# EAGLE design Preamp (EAGLE 5.07)
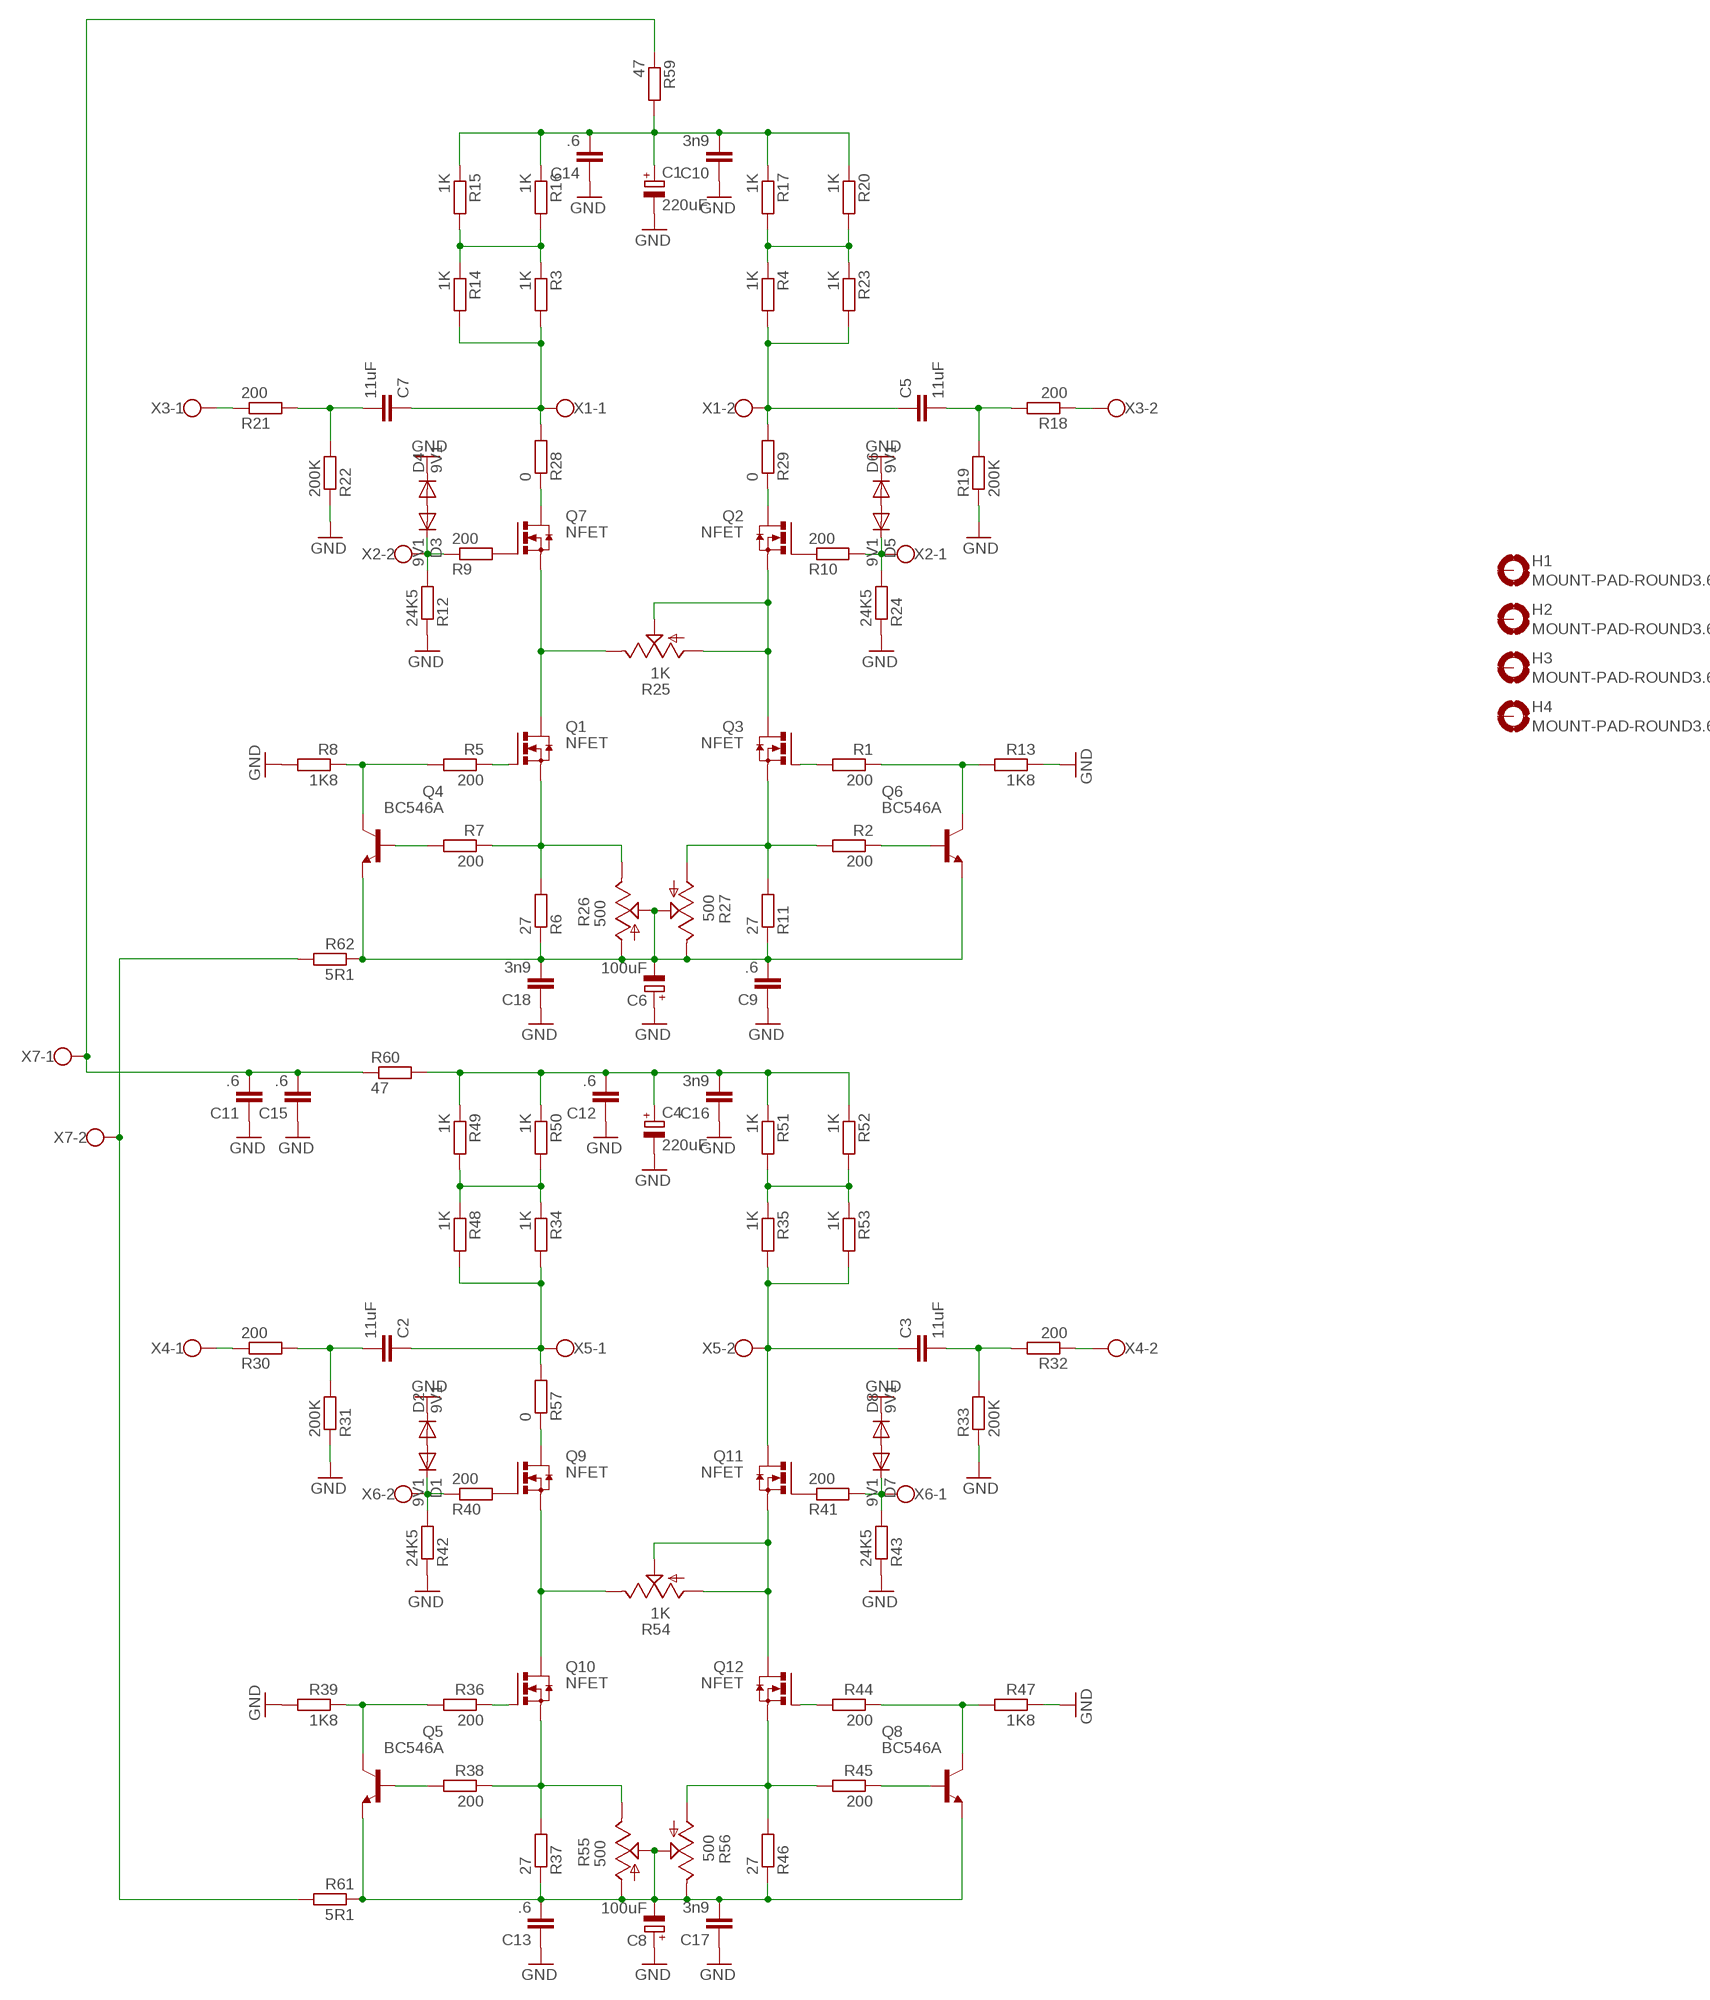
[diagram p0: schematic, sheet 1]

## Parts
C1  220uF  CPOL-EUE7.5-16  [E7,5-16]
C2  11uF  C-EU375-203X418  [C375-203X418]
C3  11uF  C-EU375-203X418  [C375-203X418]
C4  220uF  CPOL-EUE7.5-16  [E7,5-16]
C5  11uF  C-EU375-203X418  [C375-203X418]
C6  100uF  CPOL-EUE5-10.5  [E5-10,5]
C7  11uF  C-EU375-203X418  [C375-203X418]
C8  100uF  CPOL-EUE5-10.5  [E5-10,5]
C9  .6  C-EU050-045X075  [C050-045X075]
C10  3n9  C-EUC1210K  [C1210K]
C11  .6  C-EU050-045X075  [C050-045X075]
C12  .6  C-EU050-045X075  [C050-045X075]
C13  .6  C-EU050-045X075  [C050-045X075]
C14  .6  C-EU050-045X075  [C050-045X075]
C15  .6  C-EU050-045X075  [C050-045X075]
C16  3n9  C-EUC1210K  [C1210K]
C17  3n9  C-EUC1210K  [C1210K]
C18  3n9  C-EUC1210K  [C1210K]
D1  9V1  1N4148DO35-7  [DO35-7]
D2  9V1  1N4148DO35-7  [DO35-7]
D3  9V1  1N4148DO35-7  [DO35-7]
D4  9V1  1N4148DO35-7  [DO35-7]
D5  9V1  1N4148DO35-7  [DO35-7]
D6  9V1  1N4148DO35-7  [DO35-7]
D7  9V1  1N4148DO35-7  [DO35-7]
D8  9V1  1N4148DO35-7  [DO35-7]
H1  MOUNT-PAD-ROUND3.6  [3,6-PAD]
H2  MOUNT-PAD-ROUND3.6  [3,6-PAD]
H3  MOUNT-PAD-ROUND3.6  [3,6-PAD]
H4  MOUNT-PAD-ROUND3.6  [3,6-PAD]
Q1  NFET  IRFI540NPBF  [TO220BH]
Q2  NFET  IRFI540NPBF  [TO220BH]
Q3  NFET  IRFI540NPBF  [TO220BH]
Q4  BC546A  [TO92-EBC]
Q5  BC546A  [TO92-EBC]
Q6  BC546A  [TO92-EBC]
Q7  NFET  IRFI540NPBF  [TO220BH]
Q8  BC546A  [TO92-EBC]
Q9  NFET  IRFI540NPBF  [TO220BH]
Q10  NFET  IRFI540NPBF  [TO220BH]
Q11  NFET  IRFI540NPBF  [TO220BH]
Q12  NFET  IRFI540NPBF  [TO220BH]
R1  200  R-EU_0207/10  [0207/10]
R2  200  R-EU_0207/10  [0207/10]
R3  1K  R-EU_0617/22  [0617/22]
R4  1K  R-EU_0617/22  [0617/22]
R5  200  R-EU_0207/10  [0207/10]
R6  27  R-EU_0207/10  [0207/10]
R7  200  R-EU_0207/10  [0207/10]
R8  1K8  R-EU_0207/10  [0207/10]
R9  200  R-EU_0207/10  [0207/10]
R10  200  R-EU_0207/10  [0207/10]
R11  27  R-EU_0207/10  [0207/10]
R12  24K5  R-EU_0207/10  [0207/10]
R13  1K8  R-EU_0207/10  [0207/10]
R14  1K  R-EU_0617/22  [0617/22]
R15  1K  R-EU_0617/22  [0617/22]
R16  1K  R-EU_0617/22  [0617/22]
R17  1K  R-EU_0617/22  [0617/22]
R18  200  R-EU_0207/10  [0207/10]
R19  200K  R-EU_0207/10  [0207/10]
R20  1K  R-EU_0617/22  [0617/22]
R21  200  R-EU_0207/10  [0207/10]
R22  200K  R-EU_0207/10  [0207/10]
R23  1K  R-EU_0617/22  [0617/22]
R24  24K5  R-EU_0207/10  [0207/10]
R25  1K  TRIM_US-RJ9W  [RJ9W]
R26  500  TRIM_US-RJ9W  [RJ9W]
R27  500  TRIM_US-RJ9W  [RJ9W]
R28  0  R-EU_0207/10  [0207/10]
R29  0  R-EU_0207/10  [0207/10]
R30  200  R-EU_0207/10  [0207/10]
R31  200K  R-EU_0207/10  [0207/10]
R32  200  R-EU_0207/10  [0207/10]
R33  200K  R-EU_0207/10  [0207/10]
R34  1K  R-EU_0617/22  [0617/22]
R35  1K  R-EU_0617/22  [0617/22]
R36  200  R-EU_0207/10  [0207/10]
R37  27  R-EU_0207/10  [0207/10]
R38  200  R-EU_0207/10  [0207/10]
R39  1K8  R-EU_0207/10  [0207/10]
R40  200  R-EU_0207/10  [0207/10]
R41  200  R-EU_0207/10  [0207/10]
R42  24K5  R-EU_0207/10  [0207/10]
R43  24K5  R-EU_0207/10  [0207/10]
R44  200  R-EU_0207/10  [0207/10]
R45  200  R-EU_0207/10  [0207/10]
R46  27  R-EU_0207/10  [0207/10]
R47  1K8  R-EU_0207/10  [0207/10]
R48  1K  R-EU_0617/22  [0617/22]
R49  1K  R-EU_0617/22  [0617/22]
R50  1K  R-EU_0617/22  [0617/22]
R51  1K  R-EU_0617/22  [0617/22]
R52  1K  R-EU_0617/22  [0617/22]
R53  1K  R-EU_0617/22  [0617/22]
R54  1K  TRIM_US-RJ9W  [RJ9W]
R55  500  TRIM_US-RJ9W  [RJ9W]
R56  500  TRIM_US-RJ9W  [RJ9W]
R57  0  R-EU_0207/10  [0207/10]
R59  47  R-EU_0617/22  [0617/22]
R60  47  R-EU_0617/22  [0617/22]
R61  5R1  R-EU_0207/10  [0207/10]
R62  5R1  R-EU_0207/10  [0207/10]
X1  W237-02P  [W237-132]
X2  W237-02P  [W237-132]
X3  W237-02P  [W237-132]
X4  W237-02P  [W237-132]
X5  W237-02P  [W237-132]
X6  W237-02P  [W237-132]
X7  W237-02P  [W237-132]

## Nets
GND: C1.- C4.- C6.+ C8.+ C9.1 C10.1 C11.1 C12.1 C13.1 C14.1 C15.1 C16.1 C17.1 C18.1 D2.C D4.C D6.C D8.C R8.2 R12.1 R13.1 R19.1 R22.1 R24.1 R31.1 R33.1 R39.2 R42.1 R43.1 R47.1
N$1: Q3.S R2.2 R11.2 R27.A
N$2: Q3.G R1.2
N$3: Q6.B R2.1
N$4: Q6.C R1.1 R13.2
N$5: Q1.G R5.1
N$6: C6.- C9.2 C18.2 Q4.E Q6.E R6.1 R11.1 R26.A R26.S R27.E R27.S R62.1
N$7: Q4.B R7.2
N$8: Q1.S R6.2 R7.1 R26.E
N$9: Q4.C R5.2 R8.1
N$10: Q7.G R9.2
N$11: R3.1 R14.1 R15.2 R16.2
N$12: Q2.G R10.1
N$13: C7.1 R3.2 R14.2 R28.2 X1.1
N$14: Q1.D Q7.S R25.E
N$15: D3.C R9.1 R12.2 X2.2
N$16: Q2.S Q3.D R25.A R25.S
N$17: D5.C R10.2 R24.2 X2.1
N$18: Q7.D R28.1
N$19: R4.1 R17.2 R20.2 R23.1
N$20: Q2.D R29.1
N$21: R21.1 X3.1
N$22: C1.+ C10.2 C14.2 R15.1 R16.1 R17.1 R20.1 R59.2
N$23: C2.1 R34.2 R48.2 R57.2 X5.1
N$24: C2.2 R30.2 R31.2
N$25: C3.2 R32.2 R33.2
N$26: C7.2 R21.2 R22.2
N$27: C5.2 R18.2 R19.2
N$29: R30.1 X4.1
N$30: C5.1 R4.2 R23.2 R29.2 X1.2
N$31: R32.1 X4.2
N$32: Q10.G R36.1
N$42: C8.- C13.2 C17.2 Q5.E Q8.E R37.1 R46.1 R55.A R55.S R56.E R56.S R61.1
N$43: Q5.B R38.2
N$44: Q10.S R37.2 R38.1 R55.E
N$45: Q5.C R36.2 R39.1
N$52: R18.1 X3.2
N$53: D1.C R40.1 R42.2 X6.2
N$54: D7.C R41.2 R43.2 X6.1
N$55: D1.A D2.A
N$56: D7.A D8.A
N$57: Q12.S R45.2 R46.2 R56.A
N$58: Q12.G R44.2
N$59: Q8.B R45.1
N$60: Q8.C R44.1 R47.2
N$61: Q9.S Q10.D R54.E
N$62: Q11.S Q12.D R54.A R54.S
N$63: R34.1 R48.1 R49.2 R50.2
N$64: R35.1 R51.2 R52.2 R53.1
N$65: C4.+ C12.2 C16.2 R49.1 R50.1 R51.1 R52.1 R60.2
N$66: Q9.G R40.2
N$67: Q11.G R41.1
N$68: Q9.D R57.1
N$69: C3.1 Q11.D R35.2 R53.2 X5.2
N$70: C11.2 C15.2 R59.1 R60.1 X7.1
N$71: R61.2 R62.2 X7.2
N$80: D3.A D4.A
N$81: D5.A D6.A
Unconnected: H1.B3,6(MOUNT) H2.B3,6(MOUNT) H3.B3,6(MOUNT) H4.B3,6(MOUNT)

## Library data of the parts
C1 C4 C6 C8 = resistor:CPOL-EU: POLARIZED CAPACITOR, European symbol
C2 C3 C5 C7 C9-C18 = resistor:C-EU: CAPACITOR, European symbol
D1-D8 = diode:1N4148: DIODE high speed (Philips)
H1-H4 = holes:MOUNT-PAD-ROUND: MOUNTING PAD, round
Q1-Q3 Q7 Q9-Q12 = transistor-power:IRFI540NPBF: HEXFET Power MOISFET VDSS = 100V, RDS(on) = 0.052 Ohm, ID = 20A, VGS(th) = 2.0 -- 4.0V Source: http://www.irf.com/product-info/datasheets/data/irfi540npbf.pdf
Q4-Q6 Q8 = transistor-npn:BC546*: NPN Transistor
R1-R24 R28-R53 R57 R59-R62 = resistor:R-EU_: RESISTOR, European symbol
R25-R27 R54-R56 = pot:TRIM_US-: POTENTIOMETER
X1-X7 = con-wago-508:W237-02P: WAGO SREW CLAMP

## Board
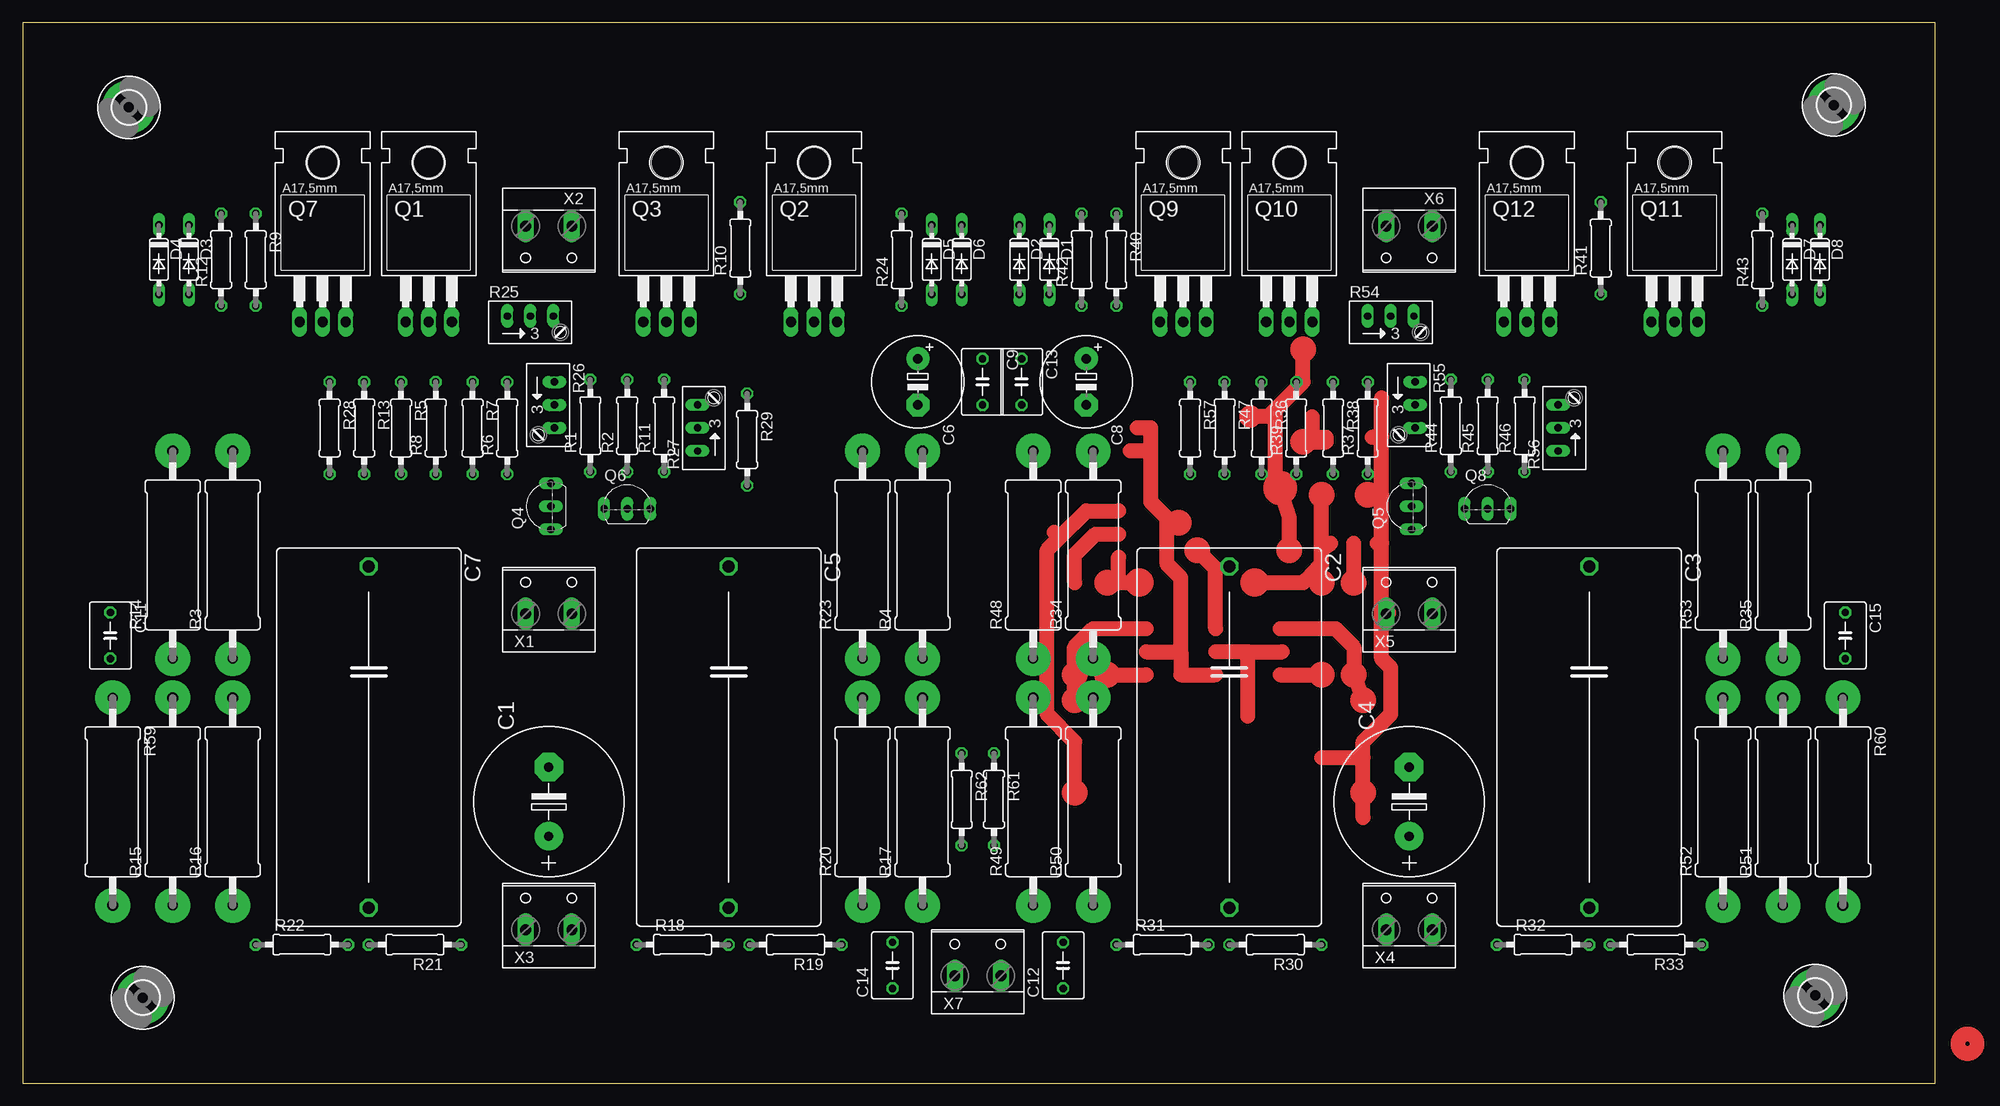
[diagram p1: board, top side]
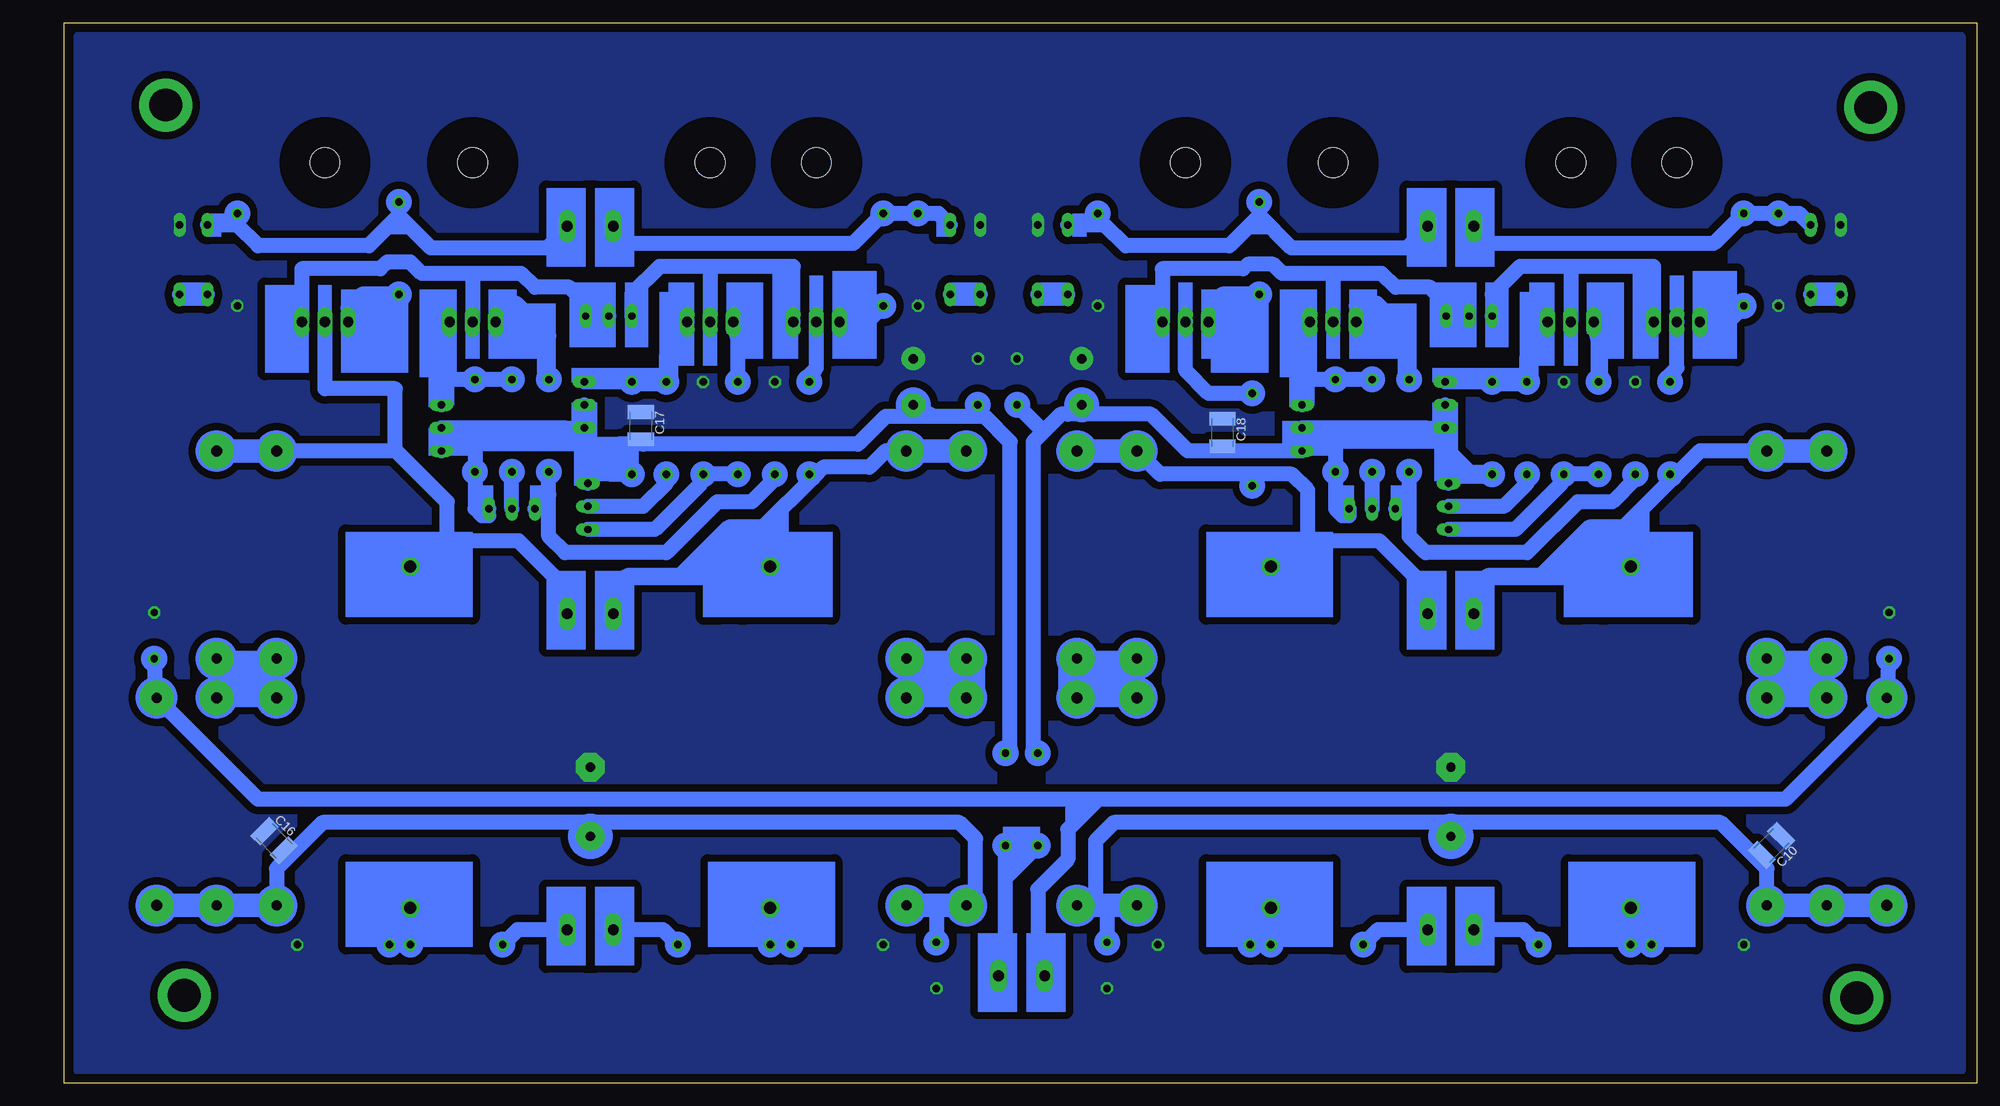
[diagram p2: board, bottom side, seen from below]

Size 210.55 x 116.76 mm. Coordinates in mm from the lower left corner, seen from the top.
Outline: 0,0 210.55,0 210.55,116.76 0,116.76 0,0
Copper layers (1*16): Top 0.035mm / dielectric 1.5mm / Bottom 0.035mm
Design rules: minimum track width 10mil, minimum drill 24mil, track to track 8mil, track to pad 8mil, pad to pad 8mil, via to via 8mil, smd to smd 8mil, copper to edge 40mil, drill to drill 8mil, minimum pad ring 10mil, minimum via ring 8mil, stop-mask expansion 4mil, vias tented up to drill 0mil, thermal gap 10mil

### Footprints (pad centres in the part's own frame; a part is rotated, then mirrored left to right if it is on the bottom)
E7,5-16 = drill 1.016 pad 3.15: + -3.81,0 | drill 1.016 pad 3.15 octagon: - 3.81,0
C375-203X418 = drill 1.321 octagon: 1 -18.796,0; 2 18.796,0
E5-10,5 = drill 1.016 pad 2.54: + -2.54,0 | drill 1.016 pad 2.54 octagon: - 2.54,0
C050-045X075 = drill 0.813 octagon: 1 -2.54,0; 2 2.54,0
C1210K = smd 1.5 x 2.9: 1 -1.5,0; 2 1.5,0
DO35-7 = drill 0.813 long: A 3.81,0; C -3.81,0
3,6-PAD = drill 3.6 pad 5.842: B3,6 0,0
TO220BH = drill 1.118 long: D 0,-6.35; G -2.54,-6.35; S 2.54,-6.35 | hole 3.302: 0,11.176
TO92-EBC = drill 0.813 long: B 0,-1.27; C -2.54,-1.27; E 2.54,-1.27
0207/10 = drill 0.813 octagon: 1 -5.08,0; 2 5.08,0
0617/22 = drill 1.1 pad 3.81: 1 -11.43,0 | drill 1.2 pad 3.81: 2 11.43,0
RJ9W = drill 0.813 long: A 2.54,0.635; E -2.54,0.635; S 0,0.635
W237-132 = drill 1.194 long: 1 -2.54,-0.635; 2 2.54,-0.635

### Placement (x,y rotation side)
C1  57.91,30.99 90 top
C2  132.84,38.1 270 top
C3  172.47,38.1 270 top
C4  152.65,30.99 90 top
C5  77.72,38.1 270 top
C6  98.55,77.22 270 top
C7  38.1,38.1 270 top
C8  117.09,77.22 270 top
C9  105.66,77.22 270 top
C10  22.61,26.16 225 bottom
C11  9.65,49.28 270 top
C12  114.55,12.95 90 top
C13  109.98,77.22 270 top
C14  95.76,12.95 90 top
C15  200.66,49.28 270 top
C16  187.45,26.67 314.9 bottom
C17  147.07,72.39 270 bottom
C18  83.06,71.63 270 bottom
D1  113.03,90.68 270 top
D2  109.73,90.68 270 top
D3  18.29,90.68 270 top
D4  14.99,90.68 270 top
D5  100.08,90.68 270 top
D6  103.38,90.68 270 top
D7  194.82,90.68 270 top
D8  197.87,90.68 270 top
H1  13.21,9.4 0 top
H2  197.36,9.65 0 top
H3  11.68,107.44 0 top
H4  199.39,107.7 0 top
Q1  44.7,90.17 0 top
Q2  87.12,90.17 0 top
Q3  70.87,90.17 0 top
Q4  56.9,63.5 90 top
Q5  151.64,63.5 90 top
Q6  66.55,64.52 0 top
Q7  33.02,90.17 0 top
Q8  161.29,64.52 0 top
Q9  127.76,90.17 0 top
Q10  139.45,90.17 0 top
Q11  181.86,90.17 0 top
Q12  165.61,90.17 0 top
R1  62.48,72.39 90 top
R2  66.55,72.39 90 top
R3  23.11,58.17 90 top
R4  99.06,58.17 90 top
R5  41.66,72.14 270 top
R6  53.34,72.14 90 top
R7  49.53,72.14 270 top
R8  45.47,72.14 90 top
R9  25.65,90.68 270 top
R10  78.99,91.95 90 top
R11  70.61,72.39 90 top
R12  21.84,90.68 90 top
R13  37.59,72.14 270 top
R14  16.51,58.17 90 top
R15  16.51,30.99 90 top
R16  23.11,30.99 90 top
R17  99.06,30.99 90 top
R18  72.64,15.24 0 top
R19  85.09,15.24 180 top
R20  92.46,30.99 90 top
R21  43.18,15.24 180 top
R22  30.73,15.24 0 top
R23  92.46,58.17 90 top
R24  96.77,90.68 90 top
R25  55.88,83.82 0 top
R26  57.91,74.68 270 top
R27  74.93,72.14 90 top
R28  33.78,72.14 270 top
R29  79.76,70.87 270 top
R30  137.92,15.24 180 top
R31  125.48,15.24 0 top
R32  167.39,15.24 0 top
R33  179.83,15.24 180 top
R34  117.86,58.17 90 top
R35  193.8,58.17 90 top
R36  136.4,72.14 270 top
R37  148.08,72.14 90 top
R38  144.27,72.14 270 top
R39  140.21,72.14 90 top
R40  120.4,90.68 270 top
R41  173.74,91.95 90 top
R42  116.59,90.68 90 top
R43  191.52,90.68 90 top
R44  157.23,72.39 90 top
R45  161.29,72.39 90 top
R46  165.35,72.39 90 top
R47  132.33,72.14 270 top
R48  111.25,58.17 90 top
R49  111.25,30.99 90 top
R50  117.86,30.99 90 top
R51  193.8,30.99 90 top
R52  187.2,30.99 90 top
R53  187.2,58.17 90 top
R54  150.62,83.82 0 top
R55  152.65,74.68 270 top
R56  169.67,72.14 90 top
R57  128.52,72.14 270 top
R59  9.91,30.99 270 top
R60  200.41,30.99 270 top
R61  106.93,31.24 270 top
R62  103.38,31.24 270 top
X1  57.91,52.32 0 top
X2  57.91,93.73 180 top
X3  57.91,17.53 0 top
X4  152.65,17.53 0 top
X5  152.65,52.32 0 top
X6  152.65,93.73 180 top
X7  105.16,12.45 0 top

### Tracks (layer width: path | path; a pad name or v marks a point on that pad's centre or on a via)
GND
  pour Bottom (isolate 0.813, no thermals): 2.03,115.06 2.03,1.52 208.79,1.52 208.79,115.06
N$1
  Bottom 1.676: R2.2 R11.2 74.3,77.47 | Q3.S 74.3,82.93 74.3,77.47 | 74.3,77.47 R27.A
N$2
  Bottom 1.676: R1.2 62.48,82.3 66.04,85.85 68.07,85.85 68.33,85.6 Q3.G
N$3
  Bottom 1.676: Q6.B R2.1
N$4
  Bottom 1.676: 62.48,64.77 Q6.C | 62.48,64.77 R1.1 | R13.2 37.59,66.55 40.13,64.01 43.94,64.01 49.53,58.42 60.71,58.42 62.48,60.2 62.48,64.77
N$5
  Bottom 1.676: Q1.G 41.66,81.79 R5.1
N$6
  Bottom 0.406: C18.2 83.31,70.13 83.31,69.6
  Bottom 1.676: R27.S R27.E | R6.1 55.63,67.06 | R26.S R26.A 58.55,69.98 | 58.55,69.98 60.71,72.14 70.61,72.14 | 70.61,72.14 R27.S | 70.61,72.14 R11.1 70.61,63.25 69.85,62.48 69.09,62.48 Q6.E | 55.63,67.06 58.55,69.98 | Q4.E 57.15,67.06 55.63,67.06 | R27.S 74.3,69.72 74.42,69.6 83.31,69.6 86.87,69.6 90.93,73.66 100.08,73.66 | 100.08,73.66 C6.- | 100.08,73.66 100.84,73.66 102.74,71.75 | R62.1 103.89,36.83 103.89,70.61 102.74,71.75 | 102.74,71.75 C9.2
N$7
  Bottom 1.676: R7.2 49.53,66.04 52.07,63.5 Q4.B
N$8
  Bottom 1.676: R26.E R6.2 R7.1 49.53,80.01 Q1.S
N$9
  Bottom 1.676: Q4.C 50.8,60.96 45.72,66.04 R8.1 R5.2
N$10
  Bottom 1.676: R9.2 27.43,83.82 Q7.G
N$11
  Bottom 1.676: R15.2 R14.1 R3.1 R16.2
N$12
  Bottom 1.676: Q2.G 84.58,85.34 83.06,86.87 R10.1
N$13
  Bottom 1.676: 33.78,66.29 R28.2 33.4,66.67 | 38.86,61.21 42.67,61.21 48.01,55.88 53.85,55.88 55.37,54.36 X1.1 | C7.1 38.1,61.21 38.86,61.21 | R14.2 R3.2 30.48,69.6 33.4,66.67 | 33.4,66.67 38.86,61.21
N$14
  Bottom 1.676: 44.7,89.92 Q1.D | 44.7,89.92 50.29,89.92 53.34,86.87 R25.E | Q7.S 35.56,89.92 44.7,89.92
N$15
  Bottom 1.676: X2.2 55.37,94.23 53.59,92.46 28.96,92.46 R9.1 R12.2 19.56,95.76 D3.C
N$16
  Bottom 1.676: 70.87,89.15 Q3.D | Q2.S 89.66,89.66 80.77,89.66 80.26,90.17 77.47,90.17 76.45,89.15 70.87,89.15 | R25.S R25.A 58.42,85.85 60.2,87.63 64.01,87.63 65.53,89.15 70.87,89.15
N$17
  Bottom 1.676: 78.99,95.5 R10.2 | 78.99,95.5 75.44,91.95 62.74,91.95 60.45,94.23 X2.1 | 78.99,95.5 82.3,92.2 93.73,92.2 96.01,94.49 96.77,94.49 | 96.77,94.49 D5.C | 96.77,94.49 R24.2
N$18
  Bottom 1.676: R28.1 33.78,77.98 33.02,78.74 Q7.D
N$19
  Bottom 1.676: R20.2 R23.1 R4.1 R17.2
N$20
  Bottom 1.676: R29.1 84.58,75.95 87.12,78.49 Q2.D
N$21
  Bottom 1.676: R21.1 49.91,16.89 X3.1
N$22
  Bottom 0.406: C10.2 23.75,24.85 23.75,24.26
  Bottom 1.676: 97.03,19.56 96.01,19.56 | 96.01,19.56 R20.1 | 97.03,19.56 R17.1 | 57.91,28.7 28.19,28.7 23.75,24.26 23.11,23.62 R16.1 R15.1 R59.2 | 57.91,28.7 C1.+ | 57.91,28.7 95,28.7 97.03,26.67 97.03,19.56 | C14.2 95.76,19.3 96.01,19.56
N$23
  Bottom 1.676: 128.52,66.29 R57.2 128.14,66.67 | 133.6,61.21 137.41,61.21 142.75,55.88 148.59,55.88 150.11,54.36 X5.1 | C2.1 132.84,61.21 133.6,61.21 | R48.2 R34.2 120.14,69.6 121.92,67.82 127,67.82 128.14,66.67 | 128.14,66.67 133.6,61.21
N$24
  Bottom 1.676: R31.2 R30.2 C2.2
N$25
  Bottom 1.676: R33.2 R32.2 C3.2
N$26
  Bottom 1.676: R22.2 R21.2 C7.2
N$27
  Bottom 1.676: R19.2 R18.2 C5.2
N$29
  Bottom 1.676: R30.1 144.65,16.89 X4.1
N$30
  Bottom 1.676: X1.2 60.45,55.12 61.21,55.12 65.79,59.69 73.66,59.69 | 73.66,59.69 77.72,59.44 C5.1 | 79.76,67.06 75.44,67.06 73.66,65.28 73.66,59.69 | 79.76,67.06 89.92,67.06 R23.2 R4.2 | 79.76,67.06 R29.2
N$31
  Bottom 1.676: 155.45,18.8 X4.2 160.66,16.89 R32.1
N$32
  Bottom 1.676: Q10.G 136.4,81.79 R36.1
N$33
  Top 1.676: 134.87,47.5 138.68,47.5 | 134.87,47.5 131.32,47.5 | 134.87,40.39 134.87,47.5
N$34
  Top 1.676: 127.51,47.5 127.51,44.96 131.32,44.96 | 127.51,47.5 127.51,55.63 125.98,57.15 125.98,61.72 | 123.7,47.5 127.51,47.5 | 125.98,61.72 125.98,62.23 124.21,64.01 124.21,69.6 | 125.98,61.72 127.25,61.72 | 124.21,69.6 121.92,69.6 | 122.68,72.14 124.21,72.14 124.21,69.6
N$35
  Top 1.676: 139.45,58.67 139.45,62.26 138.43,65.56 137.92,66.07 137.92,74.17 | 140.97,80.77 140.97,77.22 137.92,74.17 | 137.92,74.17 137.16,73.41 135.13,73.41
N$36
  Top 1.676: 147.57,42.16 146.56,44.96 146.56,48.01 144.53,50.04 138.43,50.04
N$37
  Top 1.676: 123.7,50.04 117.86,50.04 115.82,48.01 115.82,42.16
N$38
  Top 1.676: 120.65,55.12 122.94,55.12 | 120.65,55.12 119.38,55.12 | 120.65,55.12 120.65,57.91
N$39
  Top 1.676: 143,58.67 144.02,59.44 | 143,58.67 143,64.77 | 143,58.67 143,57.15 141.86,56.01 | 141.86,56.01 140.97,55.12 135.64,55.12 | 143,55.12 142.11,56.01 141.86,56.01
N$40
  Top 1.676: 120.65,62.99 117.09,62.99 114.17,60.07 | 113.58,60.66 | 114.17,60.07 113.58,60.66 | 114.17,60.07 112.78,58.67 112.78,40.64 115.82,37.59 115.82,32
N$41
  Top 1.676: 149.61,51.82 149.61,46.74 150.62,45.72 150.62,40.64 147.57,37.59 147.57,35.81 | 149.61,51.82 150.39,51.82 | 149.61,51.82 149.61,59.44 | 149.61,59.44 149.1,59.44 | 149.61,59.44 149.61,64.77 | 149.61,64.77 148.08,64.77 | 149.61,64.77 149.61,71.12 | 149.61,71.12 149.61,75.44 | 147.57,35.81 143,35.81 | 147.57,29.21 147.57,35.81 | 149.61,71.12 148.59,71.12
N$42
  Bottom 0.406: C17.2 146.81,70.89 146.81,70.36
  Bottom 1.676: R56.E R56.S 165.35,72.14 | 150.37,67.06 R37.1 | R55.S R55.A 153.29,69.98 | 153.29,69.98 155.45,72.14 165.35,72.14 | 165.35,72.14 R46.1 165.35,63.25 164.59,62.48 163.83,62.48 Q8.E | 151.64,68.33 150.37,67.06 | 151.64,68.33 153.29,69.98 | Q5.E 151.89,67.06 150.37,67.06 | 114.81,73.41 C8.- | 114.81,73.41 120.14,73.41 123.19,70.36 146.81,70.36 149.61,70.36 151.64,68.33 | 109.98,73.41 109.22,73.41 106.43,70.61 106.43,36.83 R61.1 | 109.98,73.41 114.81,73.41 | 109.98,73.41 C13.2
N$43
  Bottom 1.676: R38.2 144.27,66.04 146.81,63.5 Q5.B
N$44
  Bottom 1.676: R55.E R37.2 R38.1 144.27,80.01 Q10.S
N$45
  Bottom 1.676: Q5.C 145.54,60.96 140.46,66.04 R39.1 R36.2
N$46
  Top 1.676: 141.94,73.36 141.99,73.32 141.99,70.61 | 141.99,70.61 140.97,70.61 | 141.99,70.61 143.51,70.61 143.51,70.87 143.26,71.12 143.51,71.12
N$47
  Top 1.676: 138.43,44.96 143,44.96
N$48
  Top 1.676: 146.56,55.12 146.56,59.44
N$49
  Top 1.676: 129.29,58.67 131.32,56.64 131.32,50.04
N$50
  Top 1.676: 119.38,44.96 123.7,44.96
N$51
  Top 1.676: 120.65,60.45 118.11,60.45 115.82,58.17 115.82,55.12
N$52
  Bottom 1.676: 60.71,18.8 X3.2 65.91,16.89 R18.1
N$53
  Bottom 1.676: X6.2 150.11,94.23 148.34,92.46 123.7,92.46 R40.1 R42.2 114.3,95.76 D1.C
N$54
  Bottom 1.676: 173.74,95.5 R41.2 | 173.74,95.5 170.18,91.95 157.48,91.95 155.19,94.23 X6.1 | 173.74,95.5 177.04,92.2 189.23,92.2 191.52,94.49 | 191.52,94.49 D7.C | 191.52,94.49 R43.2
N$55
  Bottom 1.676: D2.A D1.A
N$56
  Bottom 1.676: D7.A D8.A
N$57
  Bottom 1.676: R45.2 R46.2 169.04,77.47 | Q12.S 169.04,82.93 169.04,77.47 | 169.04,77.47 R56.A
N$58
  Bottom 1.676: R44.2 157.23,82.3 160.78,85.85 162.81,85.85 163.07,85.6 Q12.G
N$59
  Bottom 1.676: Q8.B R45.1
N$60
  Bottom 1.676: 157.23,64.77 Q8.C | 157.23,64.77 R44.1 | R47.2 132.33,66.55 134.87,64.01 138.68,64.01 144.27,58.42 155.45,58.42 157.23,60.2 157.23,64.77
N$61
  Bottom 1.676: 139.45,89.92 Q10.D | 139.45,89.92 145.03,89.92 148.08,86.87 R54.E | Q9.S 130.3,89.92 139.45,89.92
N$62
  Bottom 1.676: 165.61,89.15 Q12.D | Q11.S 184.4,89.66 175.77,89.66 175.01,90.42 172.47,90.42 171.2,89.15 165.61,89.15 | R54.S R54.A 153.16,85.85 154.94,87.63 158.75,87.63 160.27,89.15 165.61,89.15
N$63
  Bottom 1.676: R49.2 R48.1 R34.1 R50.2
N$64
  Bottom 1.676: R52.2 R53.1 R35.1 R51.2
N$65
  Bottom 0.406: C16.2 185.8,25.61 185.8,25.02
  Bottom 1.676: 114.55,19.56 R49.1 110.74,19.56 110.24,20.07 110.24,26.92 112.01,28.7 152.65,28.7 | 114.55,19.56 R50.1 | 152.65,28.7 182.12,28.7 185.8,25.02 187.2,23.62 R52.1 R51.1 R60.2 | 152.65,28.7 C4.+ | 114.55,19.56 C12.2
N$66
  Bottom 1.676: R40.2 122.17,83.82 Q9.G
N$67
  Bottom 1.676: Q11.G 179.32,85.34 177.8,86.87 R41.1
N$68
  Bottom 1.676: R57.1 128.52,77.98 127.76,78.74 Q9.D
N$69
  Bottom 1.676: X5.2 155.19,55.12 155.96,55.12 160.53,59.69 168.4,59.69 | 168.4,59.69 172.47,59.44 C3.1 | R35.2 R53.2 174.12,69.6 174.12,69.72 | 168.4,59.69 168.4,64.01 174.12,69.72 | Q11.D 181.86,76.45 174.12,76.45 174.12,69.72
N$70
  Bottom 1.676: 96.77,31.24 189.23,31.24 R60.1 C15.2 | X7.1 103.38,12.57 103.38,21.34 100.08,24.64 100.08,27.94 96.77,31.24 | 96.77,31.24 21.08,31.24 R59.1 C11.2
N$71
  Bottom 1.676: X7.2 106.93,12.57 106.93,22.61 | 106.93,22.61 R61.2 | 106.93,22.61 R62.2
N$80
  Bottom 1.676: D4.A D3.A
N$81
  Bottom 1.676: D5.A D6.A
(copper drawn outside any net)
  shapes: Bottom area x180, Bottom circle x120, Top area x3, Top circle x24